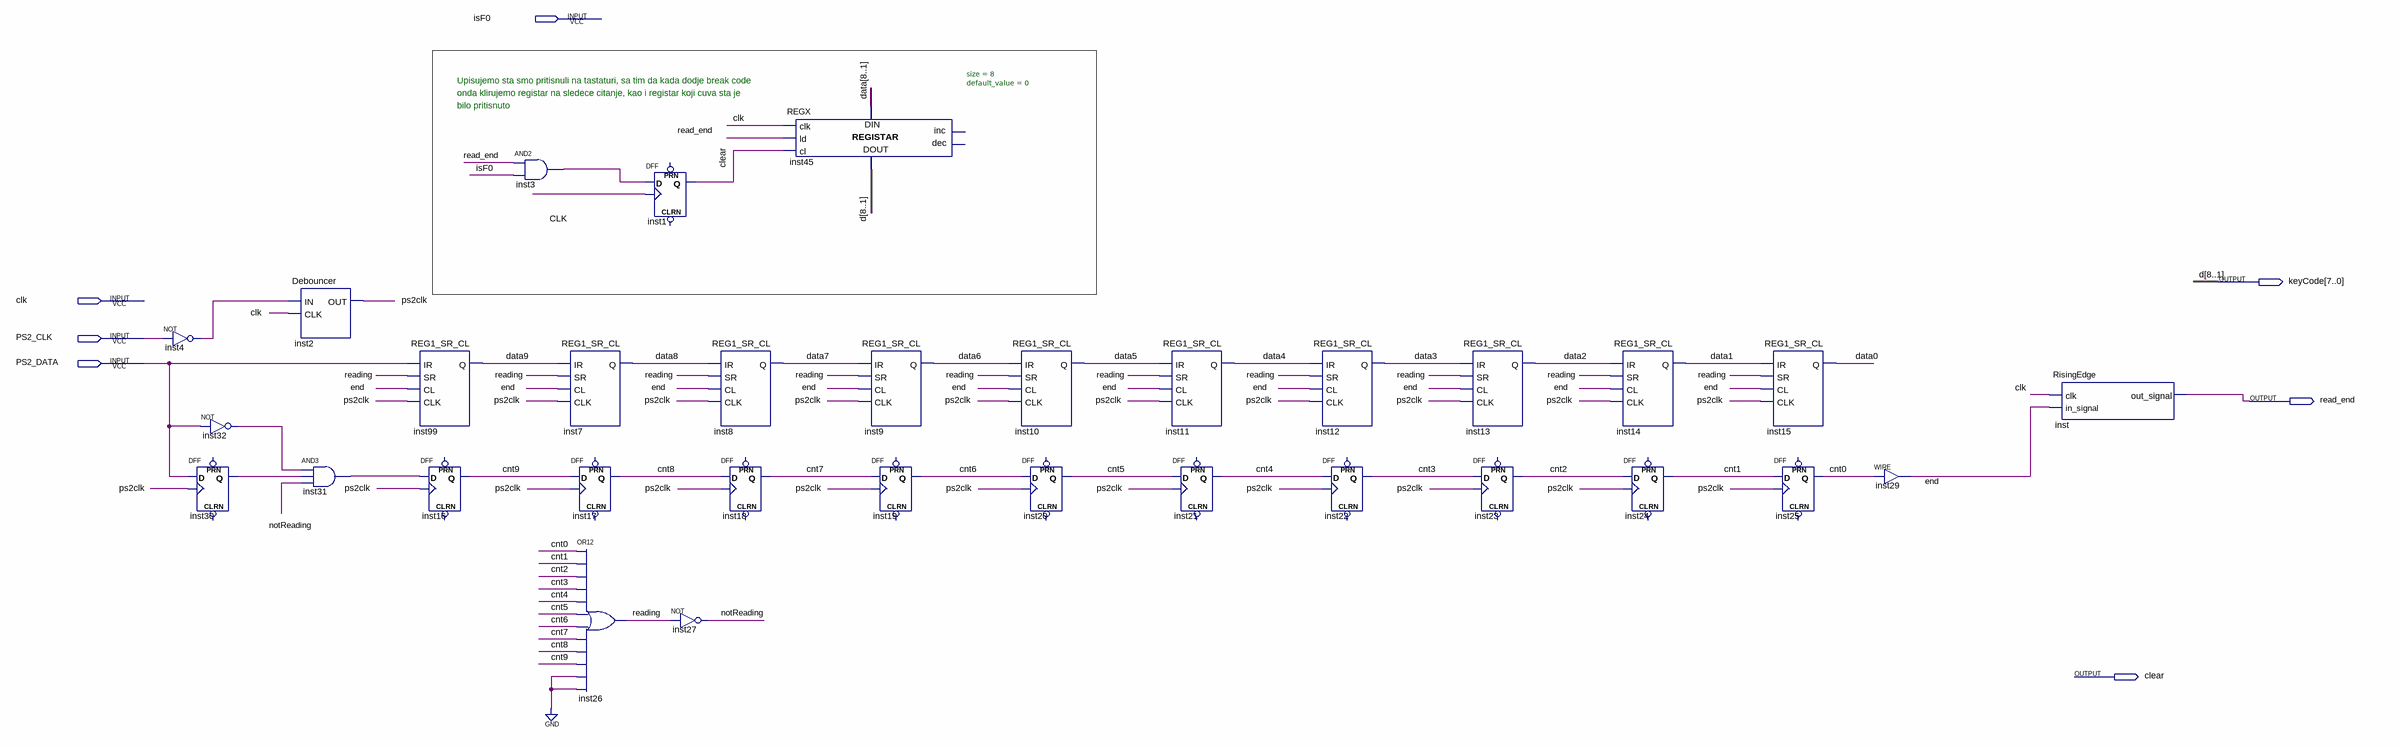
[diagram p0: schematic sheet]
// Quartus schematic keyBoardInterface.bdf as structural Verilog: 32 symbols, 7 pins
module keyBoardInterface (
  input  isF0,
  input  clk,
  input  PS2_CLK,
  input  PS2_DATA,
  output [7:0] keyCode,
  output read_end,
  output clear
);

  wire cnt0, cnt1, cnt2, cnt3, cnt4, cnt5, cnt6, cnt7, cnt8, cnt9, data0, data9, \end , inst3_out, inst4_out,
       inst30_q, inst31_out, inst32_out, notReading, ps2clk, reading;
  wire [8:1] data;

  not inst4 (inst4_out, PS2_CLK);
  not inst32 (inst32_out, PS2_DATA);
  DFF inst30 (.CLK(ps2clk), .D(PS2_DATA), .Q(inst30_q));  // open: CLRN, PRN
  Debouncer inst2 (.IN(inst4_out), .CLK(clk), .OUT(ps2clk));
  and inst31 (inst31_out, inst32_out, inst30_q, notReading);
  REG1_SR_CL inst99 (.IR(PS2_DATA), .SR(reading), .CL(\end ), .CLK(ps2clk), .Q(data9));
  DFF inst16 (.CLK(ps2clk), .D(inst31_out), .Q(cnt9));  // open: CLRN, PRN
  and inst3 (inst3_out, read_end, isF0);
  REG1_SR_CL inst7 (.IR(data9), .SR(reading), .CL(\end ), .CLK(ps2clk), .Q(data[8]));
  DFF inst17 (.CLK(ps2clk), .D(cnt9), .Q(cnt8));  // open: CLRN, PRN
  or inst26 (reading, cnt0, cnt1, cnt2, cnt3, cnt4, cnt5, cnt6, cnt7, cnt8, cnt9, 1'b0, 1'b0);
  DFF inst1 (.CLK(clk), .D(inst3_out), .Q(clear));  // open: CLRN, PRN
  not inst27 (notReading, reading);
  REG1_SR_CL inst8 (.IR(data[8]), .SR(reading), .CL(\end ), .CLK(ps2clk), .Q(data[7]));
  DFF inst18 (.CLK(ps2clk), .D(cnt8), .Q(cnt7));  // open: CLRN, PRN
  REGX #(.size(8), .default_value(0)) inst45 (
    .clk(clk), .ld(read_end), .cl(clear), .data_in(data), .data_out(keyCode));  // open: inc, dec
  REG1_SR_CL inst9 (.IR(data[7]), .SR(reading), .CL(\end ), .CLK(ps2clk), .Q(data[6]));
  DFF inst19 (.CLK(ps2clk), .D(cnt7), .Q(cnt6));  // open: CLRN, PRN
  REG1_SR_CL inst10 (.IR(data[6]), .SR(reading), .CL(\end ), .CLK(ps2clk), .Q(data[5]));
  DFF inst20 (.CLK(ps2clk), .D(cnt6), .Q(cnt5));  // open: CLRN, PRN
  REG1_SR_CL inst11 (.IR(data[5]), .SR(reading), .CL(\end ), .CLK(ps2clk), .Q(data[4]));
  DFF inst21 (.CLK(ps2clk), .D(cnt5), .Q(cnt4));  // open: CLRN, PRN
  REG1_SR_CL inst12 (.IR(data[4]), .SR(reading), .CL(\end ), .CLK(ps2clk), .Q(data[3]));
  DFF inst22 (.CLK(ps2clk), .D(cnt4), .Q(cnt3));  // open: CLRN, PRN
  REG1_SR_CL inst13 (.IR(data[3]), .SR(reading), .CL(\end ), .CLK(ps2clk), .Q(data[2]));
  DFF inst23 (.CLK(ps2clk), .D(cnt3), .Q(cnt2));  // open: CLRN, PRN
  REG1_SR_CL inst14 (.IR(data[2]), .SR(reading), .CL(\end ), .CLK(ps2clk), .Q(data[1]));
  DFF inst24 (.CLK(ps2clk), .D(cnt2), .Q(cnt1));  // open: CLRN, PRN
  REG1_SR_CL inst15 (.IR(data[1]), .SR(reading), .CL(\end ), .CLK(ps2clk), .Q(data0));
  DFF inst25 (.CLK(ps2clk), .D(cnt1), .Q(cnt0));  // open: CLRN, PRN
  assign \end  = cnt0;  // WIRE inst29
  RisingEdge inst (.clk(clk), .in_signal(\end ), .out_signal(read_end));

  // Other names for the same wires on the sheet: d[8:1] = keyCode

  // Notes on the sheet:
  //   Upisujemo sta smo pritisnuli na tastaturi, sa tim da kada dodje break code                                                       
  //   onda klirujemo registar na sledece citanje, kao i registar koji cuva sta je 
  //   bilo pritisnuto                                        
endmodule
